# EAGLE design OpenBlink (EAGLE 5.11)
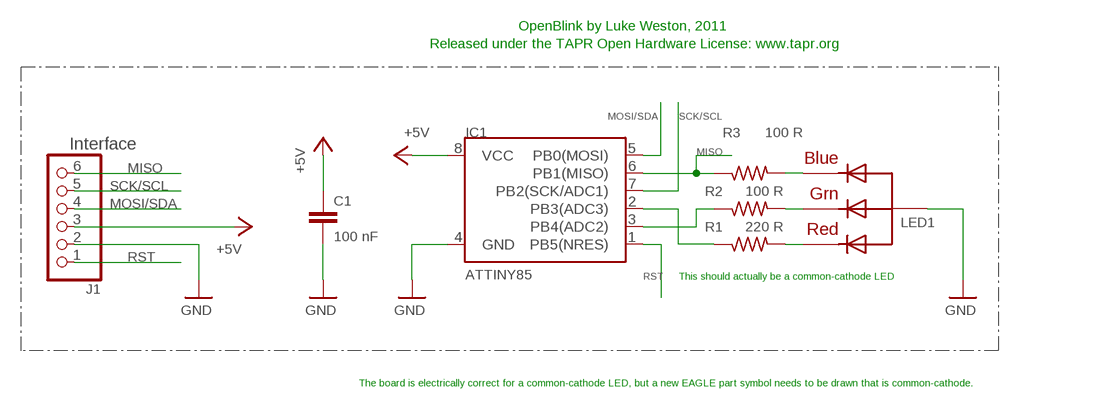
[diagram p0: schematic, sheet 1]

## Parts
C1  100 nF  C-EUC0805K  [C0805K]
IC1  ATTINY85  ATTINY45  [SO08-EIAJ]
J1  Interface  PINHD-1X6  [1X06]
LED1  RGB  RGBLED_CA-PIRANHA  [PIRANHA5MM]
R1  220 R  R-US_R0805  [R0805]
R2  100 R  R-US_R0805  [R0805]
R3  100 R  R-US_R0805  [R0805]

## Nets
+5V: C1.1 IC1.8(VCC) J1.3
GND: C1.2 IC1.4(GND) J1.2 LED1.4(VCC)
MISO: IC1.6(PB1(MISO)) J1.6 R3.1
MOSI/SDA: IC1.5(PB0(MOSI)) J1.4
N$2: IC1.2(PB3(ADC3)) R1.1
N$3: IC1.3(PB4(ADC2)) R2.1
N$4: LED1.2(RED) R1.2
N$5: LED1.3(GREEN) R2.2
N$6: LED1.1(BLUE) R3.2
RST: IC1.1(PB5(NRES)) J1.1
SCK/SCL: IC1.7(PB2(SCK/ADC1)) J1.5

## Notes on the sheet
- OpenBlink by Luke Weston, 2011
- Released under the TAPR Open Hardware License: www.tapr.org
- This should actually be a common-cathode LED
- The board is electrically correct for a common-cathode LED, but a new EAGLE part symbol needs to be drawn that is common-cathode.

## Library data of the parts
C1 = rcl:C-EU: CAPACITOR, European symbol
IC1 = SparkFun:ATTINY45: Atmel ATTiny45
J1 = pinhead:PINHD-1X6: PIN HEADER
LED1 = adafruit:RGBLED_CA: RGB LED, common-anode 5MM Staggered pins 5mm Piranha package http://www.ladyada.net/library/pcb/eaglelibrary.html
R1-R3 = rcl:R-US_: RESISTOR, American symbol

## Board
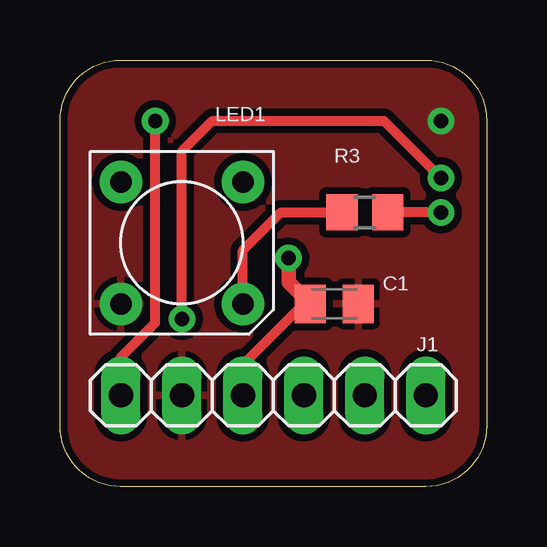
[diagram p1: board, top side]
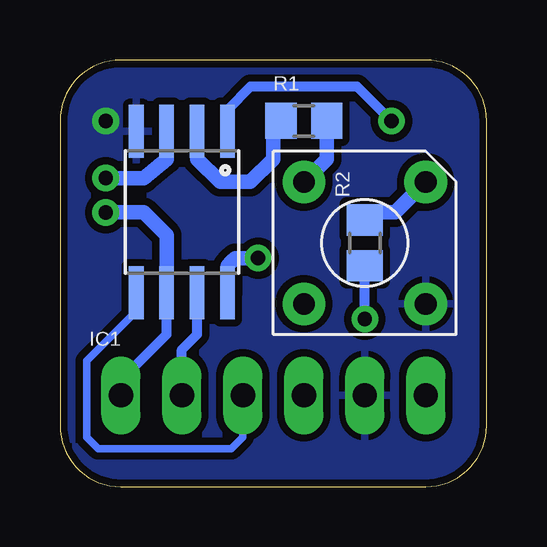
[diagram p2: board, bottom side, seen from below]

Size 17.78 x 17.78 mm. Coordinates in mm from the lower left corner, seen from the top.
Outline: 2.54,0 arc-90 0,2.54 0,15.24 arc-90 2.54,17.78 15.24,17.78 arc-90 17.78,15.24 17.78,2.54 arc-90 15.24,0 2.54,0
Copper layers (1*16): Top 0.035mm / dielectric 1.5mm / Bottom 0.035mm
Design rules "SparkFun.drc": minimum track width 8mil, minimum drill 20mil, track to track 8mil, track to pad 8mil, pad to pad 8mil, via to via 8mil, smd to smd 8mil, copper to edge 10mil, drill to drill 8mil, minimum pad ring 12mil, minimum via ring 10mil, stop-mask expansion 4mil, vias tented up to drill 25mil, thermal gap 10mil

### Footprints (pad centres in the part's own frame; a part is rotated, then mirrored left to right if it is on the bottom)
C0805K = smd 1.3 x 1.6: 1 -1,0; 2 1,0
SO08-EIAJ = smd 0.61 x 2.21: 1 -1.905,-3.378; 2 -0.635,-3.378; 3 0.635,-3.378; 4 1.905,-3.378; 5 1.905,3.353; 6 0.635,3.353; 7 -0.635,3.353; 8 -1.905,3.353
1X06 = drill 1.016 long: 1 -6.35,0; 2 -3.81,0; 3 -1.27,0; 4 1.27,0; 5 3.81,0; 6 6.35,0
PIRANHA5MM = drill 0.9 pad 1.778 round: 1 -2.54,2.54; 2 -2.54,-2.54; 3 2.54,-2.54; 4 2.54,2.54
R0805 = smd 1.3 x 1.5: 1 -0.95,0; 2 0.95,0

### Placement (x,y rotation side)
C1  11.43,7.62 0 top
IC1  12.7,11.43 180 bottom
J1  8.89,3.81 0 top
LED1  5.08,10.16 180 top
R1  7.62,15.24 0 bottom
R2  5.08,10.16 90 bottom
R3  12.7,11.43 180 top

### Tracks (layer width: path | path; a pad name or v marks a point on that pad's centre or on a via)
+5V  (via drill 0.6)
  Top 0.305: 10.16,7.62 C1.1
  Top 0.406: J1.3 7.62,5.08 10.16,7.62
  Top 0.61: v9.53,9.53 9.53,8.53 C1.1
  Bottom 0.305: IC1.8 10.79,8.26
  Bottom 0.61: v9.53,9.53 10.48,9.53 10.64,9.37 10.79,9.21 10.79,8.89 IC1.8
GND  (via drill 0.6)
  other vias: 15.88,15.24
  pour Top (isolate 0.305): -0.64,-0.64 -0.64,19.05 18.57,18.89 18.57,-0.79
  pour Bottom (isolate 0.305): -1.27,-1.27 -1.27,19.68 19.05,19.68 19.05,-1.27
MISO  (via drill 0.6)
  Top 0.406: v15.88,11.43 R3.1
  Bottom 0.406: J1.6 15.24,4.44 13.34,6.35 IC1.6
  Bottom 0.61: v15.88,11.43 14.29,11.43 13.34,10.48 IC1.6
MOSI/SDA
  Bottom 0.305: IC1.5 14.61,7.3 16.67,5.24 16.67,2.06 16.19,1.59 10.64,1.59 10.16,2.06 J1.4
N$2
  Bottom 0.305: 8.89,14.92 R1.1
  Bottom 0.61: IC1.2 12.07,13.65 11.11,12.7 9.84,12.7 8.89,13.65 8.89,14.92
N$3  (via drill 0.6)
  Top 0.406: v15.88,12.86 13.49,15.24 6.35,15.24 5.08,13.97 v5.08,6.99
  Bottom 0.406: v5.08,6.99 R2.1 | 13.34,13.65 IC1.3
  Bottom 0.61: 13.34,13.65 14.29,12.86 v15.88,12.86
N$4
  Bottom 0.61: R1.2 6.67,13.65 LED1.2
N$5
  Bottom 0.406: 4.76,11.43 R2.2
  Bottom 0.61: LED1.3 3.81,11.43 4.76,11.43
N$6
  Top 0.406: R3.2 9.21,11.43 7.62,9.84 LED1.1
RST  (via drill 0.6)
  Top 0.305: 3.81,6.67
  Top 0.406: J1.1 2.54,5.4 3.81,6.67 | 3.81,6.67 3.97,6.83 v3.97,15.24
  Bottom 0.305: 10.79,15.72 IC1.1
  Bottom 0.406: 10.79,15.72 9.84,16.67 5.4,16.67 v3.97,15.24
SCK/SCL
  Bottom 0.406: J1.5 12.7,5.71 12.07,6.35 IC1.7

### Text on the board
Document: Dimensions = 17.8 mm square
tDocu: by Luke Weston, 2011 | OpenBlink | RST | GND | +5V | MOSI | SCK | MISO | SDA | SCL